# Altium project opa1671音频放大.PrjPCB
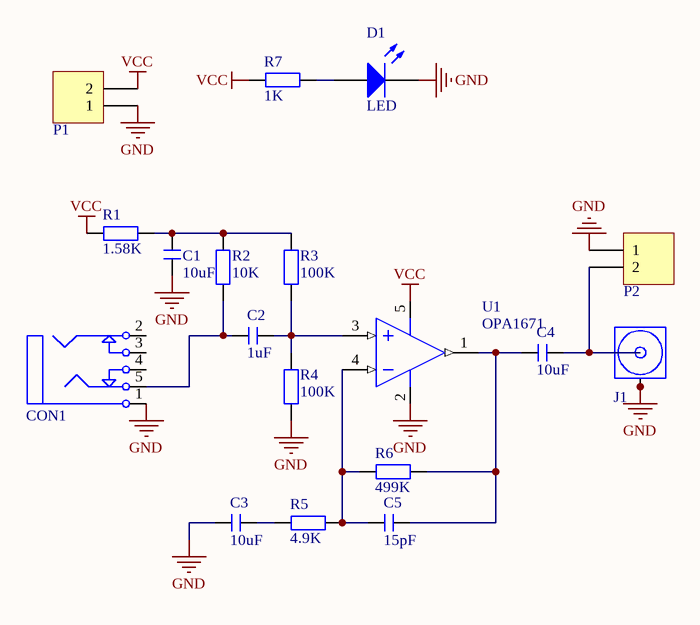
[diagram p0: opa1671音频放大.SchDoc]
1 sheet, 18 parts. Net scope: global (net labels, ports and power ports of the same name join across sheets).
Board file: opa1671驻极体放大.PcbDoc

## Sheet opa1671音频放大.SchDoc
size A4

### Parts
C1  10uF  [C 0805]
C2  1uF  [C 0805]
C3  10uF  [C 0805]
C4  10uF  [C 0805]
C5  15pF  [C 0603]
CON1  3F07_BK  [3F07_BK]  (value not drawn)
D1  LED  [LED_0805]
J1  COAX  [MCX5.08-5-H]  (value not drawn)
P1  Header 2  [HDR2X1_B2]  (value not drawn)
P2  Header 2  [HDR2X1_A]  (value not drawn)
R1  1.58K  [R 0603]
R2  10K  [R 0603]
R3  100K  [R 0603]
R4  100K  [R 0603]
R5  4.9K  [R 0603]
R6  499K  [R 0603]
R7  1K  [R 0805]
U1  OPA1671  [SC-70 5]

### Nets
GND: C1.1 C3.1 CON1.1 D1.2(K) J1.2(GND) J1.3(GND) J1.4(GND) J1.5(GND) P1.1 P2.1 R4.2 U1.2(V-)
VCC: P1.2 R1.1 R7.1 U1.5(V+)
NetC1_2: C1.2 R1.2 R2.1 R3.1
NetC2_1: C2.1 CON1.5 R2.2
NetC2_2: C2.2 R3.2 R4.1 U1.3(+IN)
NetC3_2: C3.2 R5.1
NetC4_1: C4.1 C5.2 R6.2 U1.1(OUT)
NetC4_2: C4.2 J1.1(Signal) P2.2
NetC5_1: C5.1 R5.2 R6.1 U1.4(-IN)
NetD1_1: D1.1(A) R7.2

Not connected (* = marked no-connect by the designer): CON1 2 3 4

### Library data of the parts
C1-C5 = C: 无极性贴片电容; 版权归属: 源创客; BOM名称: 无极性贴片电容; 学习资源: www.ooocke.com
CON1 = 3F07: 3.5mm耳机插座; BOM名称: 耳机插座; 版权归属: 源创客; 学习资源: www.ooocke.com
D1 = LED: 发光二极管; Published: 8-Jun-2000; LatestRevisionDate: 08-Jul-2005; LatestRevisionNote: Mech Layer 1 removed.; PackageReference: LED; Publisher: Altium Limited
P1 P2 = Header 2: 接插件; LatestRevisionDate: 17-Jul-2002; LatestRevisionNote: Re-released for DXP Platform.; Publisher: Altium Limited
R1-R7 = R: 贴片电阻; 版权归属: 源创客; BOM名称: 贴片电阻; 学习资源: www.ooocke.com
U1 = opa1671: 12MHz、低噪声、轨至轨、音频运算放大器